# EAGLE design WS2812-Breakout_v11 (EAGLE 7.5.0)
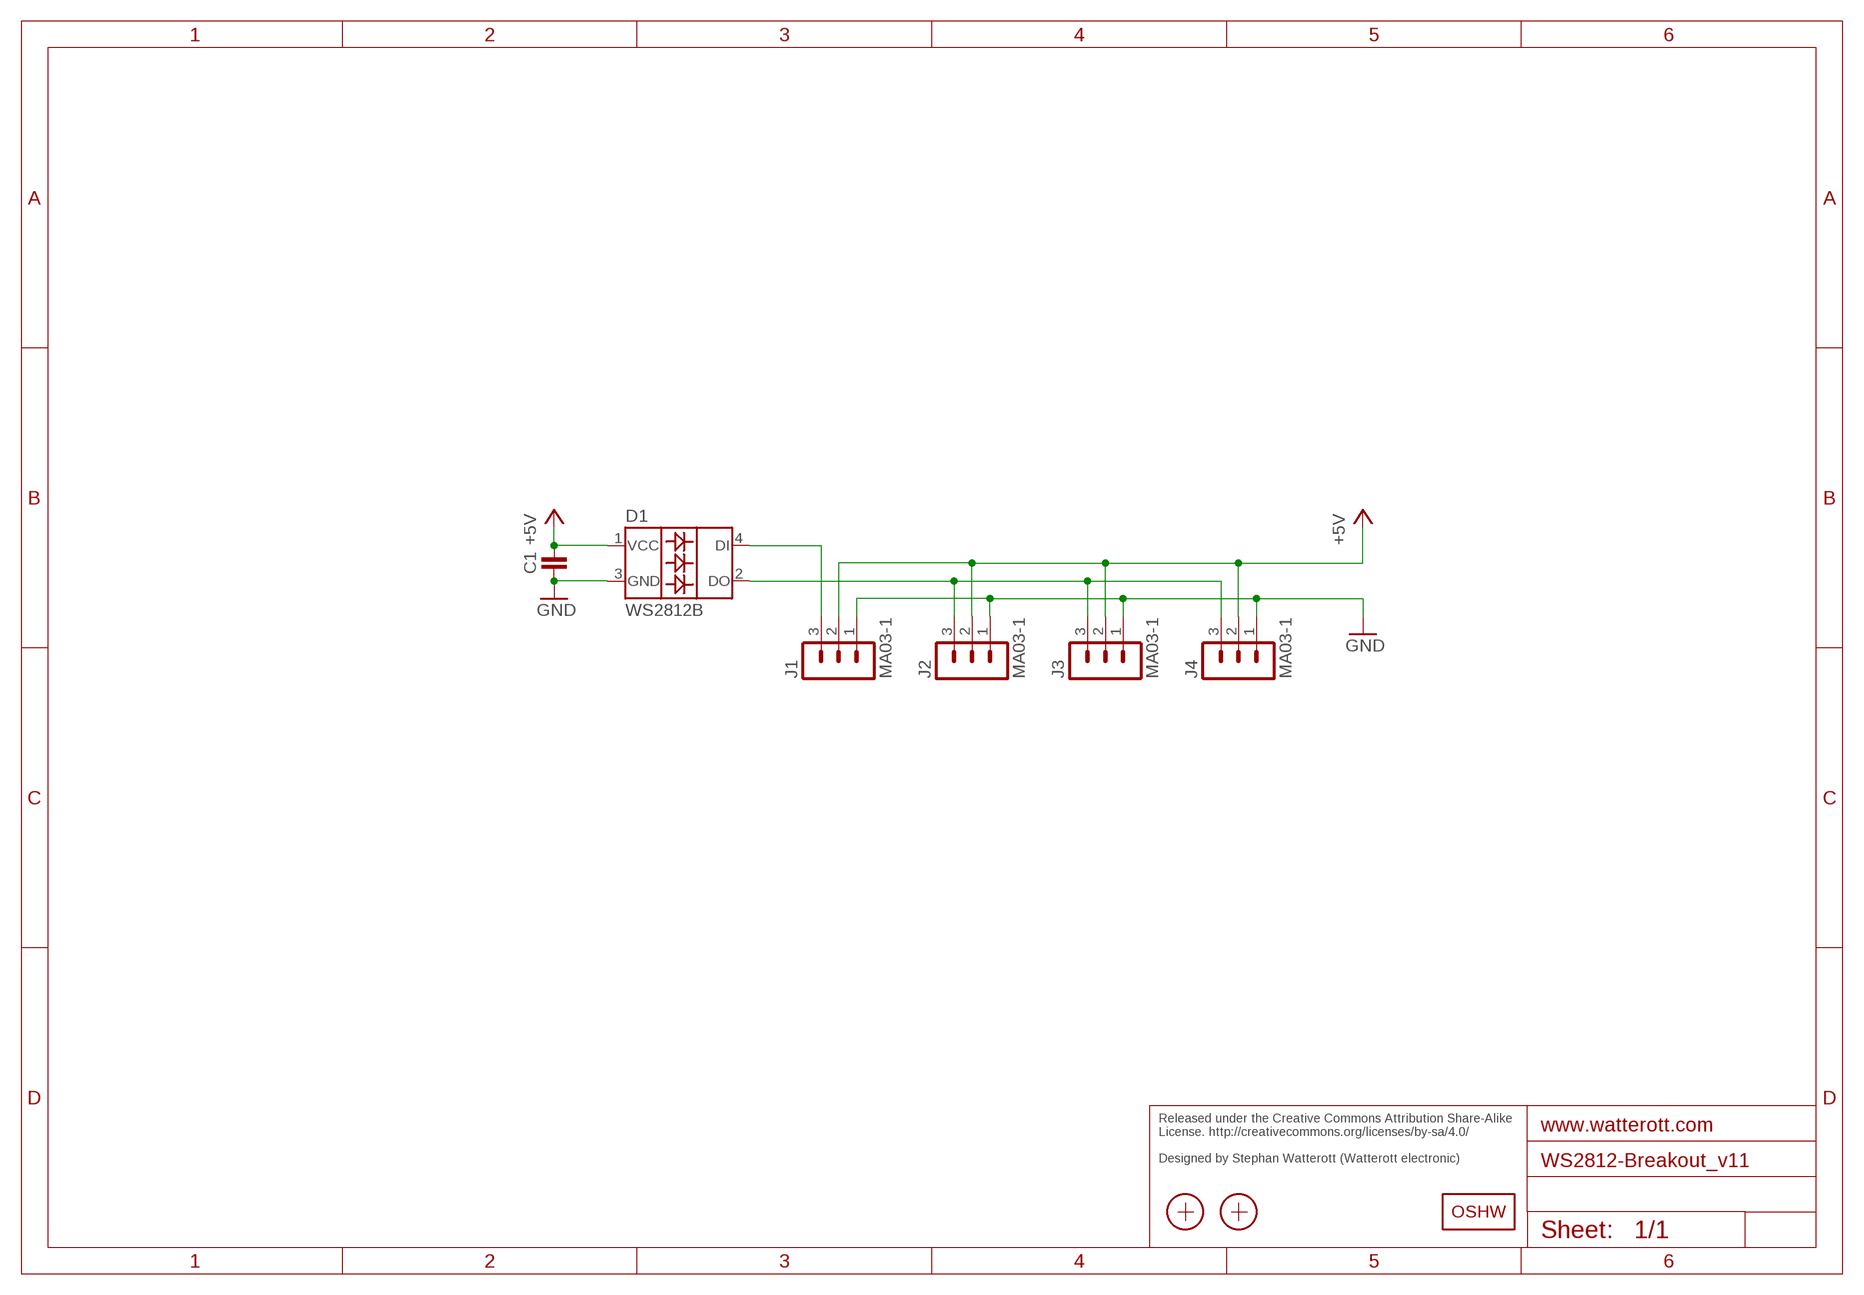
[diagram p0: schematic, sheet 1]

## Parts
C1  CAPACITOR-0402  [C0402]
D1  WS2812B  [WS2812B]
J1  MA03-1  [MA03-1]
J2  MA03-1  [MA03-1]
J3  MA03-1  [MA03-1]
J4  MA03-1  [MA03-1]
LOGO1  OSHW_LOGOX0070  [OSHW_6X70]
X1  PASSER-07  [PASSER_07MM]
X2  PASSER-07  [PASSER_07MM]

## Nets
+5V: C1.2 D1.1(VCC) J1.2 J2.2 J3.2 J4.2
GND: C1.1 D1.3(GND) J1.1 J2.1 J3.1 J4.1
N$1: D1.4(DI) J1.3
N$2: D1.2(DO) J2.3 J3.3 J4.3

## Notes on the sheet
- Released under the Creative Commons Attribution Share-Alike 
  License. http://creativecommons.org/licenses/by-sa/4.0/
  
  Designed by Stephan Watterott (Watterott electronic)

## Library data of the parts
C1 = we-rcl:CAPACITOR: Capacitors ...4.7uF @ 6.3V -> 0402 ...10uF @ 16V -> 0603 ...22uF @ 25V -> 0805
D1 = we-opto:WS2812B: WS2812 Intelligent RGB LED
J1-J4 = we-con:MA03-1: Pin Header
LOGO1 = we-symbol:OSHW_LOGO: Open-Source-Hardware Logo
X1 X2 = we-symbol:PASSER: Fiducial Markers

## Board
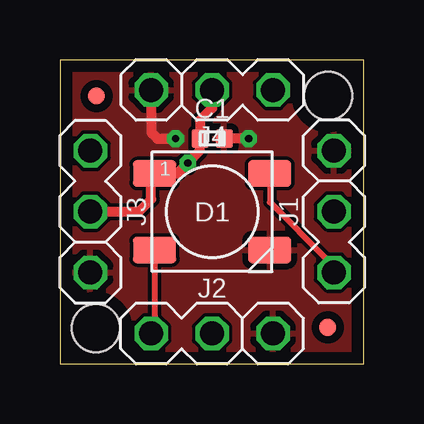
[diagram p1: board, top side]
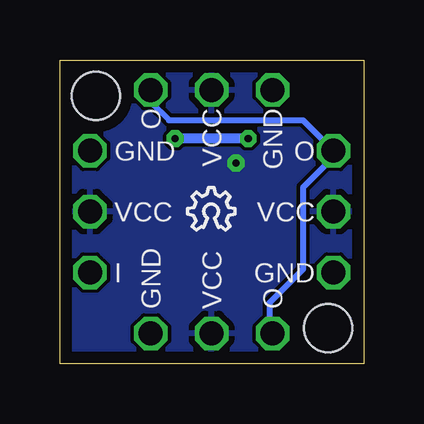
[diagram p2: board, bottom side, seen from below]

Size 12.68 x 12.68 mm. Coordinates in mm from the lower left corner, seen from the top.
Outline: 0,0 12.68,0 12.68,12.68 0,12.68 0,0
Copper layers (1*16): Top 0.035mm / dielectric 1.5mm / Bottom 0.035mm
Design rules "we-dru[1]": minimum track width 0.15mm, minimum drill 0.3mm, track to track 0.15mm, track to pad 0.15mm, pad to pad 0.15mm, via to via 0.15mm, smd to smd 0.1mm, copper to edge 0.5mm, drill to drill 0.2mm, minimum pad ring 0.18mm, minimum via ring 0.2mm, stop-mask expansion 0.1mm, vias tented up to drill 0.5mm, thermal gap 0.25mm
Holes 2 mm at 11.18,11.18 1.5,1.5

### Footprints (pad centres in the part's own frame; a part is rotated, then mirrored left to right if it is on the bottom)
C0402 = smd 0.75 x 0.7: 1 0,0.5; 2 0,-0.5
WS2812B = smd 1.8 x 1.1: 1 -2.4,1.6; 2 -2.4,-1.6; 3 2.4,-1.6; 4 2.4,1.6
MA03-1 = drill 1 octagon: 1 0,2.54; 2 0,0; 3 0,-2.54
PASSER_07MM = smd 0.7 x 0.7: X 0,0

### Placement (x,y rotation side)
C1  6.35,9.4 270 top
D1  6.35,6.35 0 top
J1  11.43,6.35 0 top
J2  6.35,1.27 270 top
J3  1.27,6.35 180 top
J4  6.35,11.43 90 top
LOGO1  7.37,5.59 0 bottom
X1  1.52,11.18 0 top
X2  11.18,1.52 0 top

### Tracks (layer width: path | path; a pad name or v marks a point on that pad's centre or on a via)
+5V  (via drill 0.3)
  Top 0.406: J4.2 6.35,10.67 5.84,10.16 C1.2 5.84,8.89 v5.33,8.38 5.08,8.13 4.9,7.95 D1.1 3.81,7.81 3.81,6.86 3.3,6.35 J3.2
  pour Bottom: 0,0 12.7,0 12.7,12.7 0,12.7
GND  (via drill 0.3)
  Top 0.406: J4.1 3.81,9.65 4.06,9.4 v4.83,9.4 | v7.87,9.4 C1.1
  Bottom 0.406: v4.83,9.4 v7.87,9.4
  pour Top: 0,0 12.7,0 12.7,12.7 0,12.7
N$1
  Top 0.254: D1.4 8.75,6.74 11.18,4.32 11.18,4.06 J1.3
N$2
  Top 0.254: D1.2 3.95,1.41 J2.3
  Bottom 0.254: J4.3 8.89,10.92 8.13,10.16 2.54,10.16 J3.3 1.27,8.64 2.54,7.37 2.54,3.95 3.95,2.54 3.95,1.41 J2.3

### Text on the board
bPlace: GND | VCC | O | O | GND | VCC | VCC | GND | I | O | VCC | GND
Reference: Silkscreen: 22 bPlace